# Altium schematic sheet Sheet_Connect[1].SchDoc
size A1
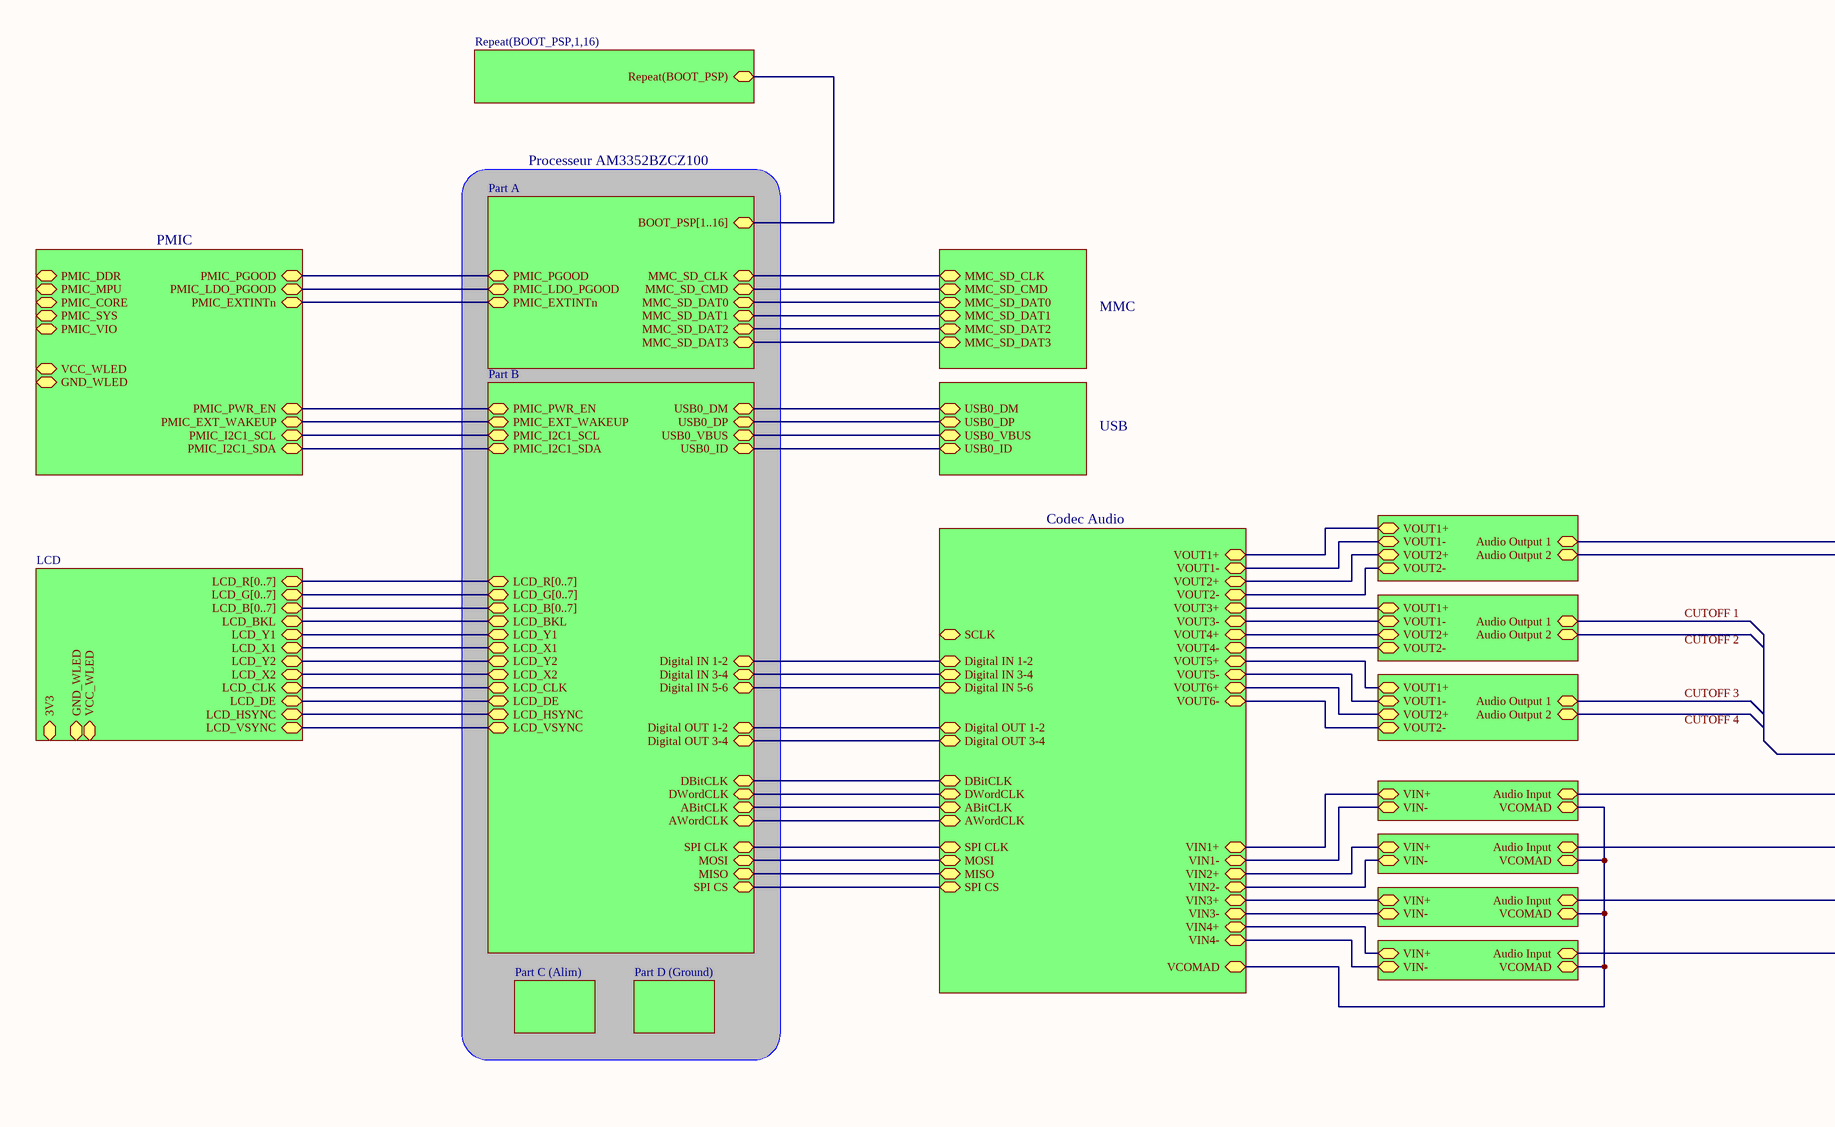
[diagram p0: Sheet_Connect[1].SchDoc, top left]
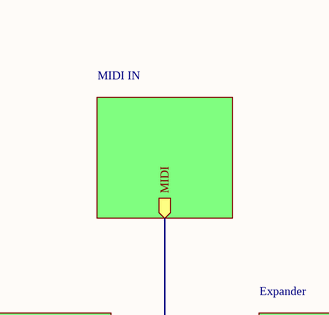
[diagram p1: Sheet_Connect[1].SchDoc, top right]
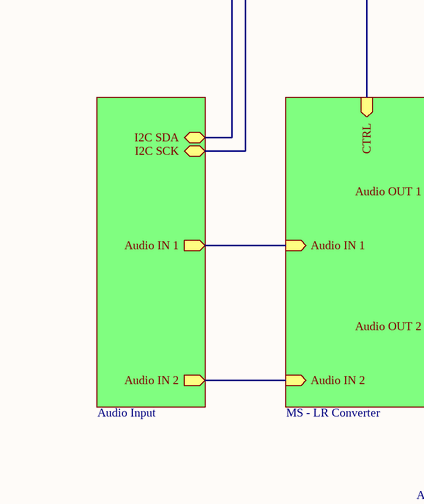
[diagram p2: Sheet_Connect[1].SchDoc, bottom left]
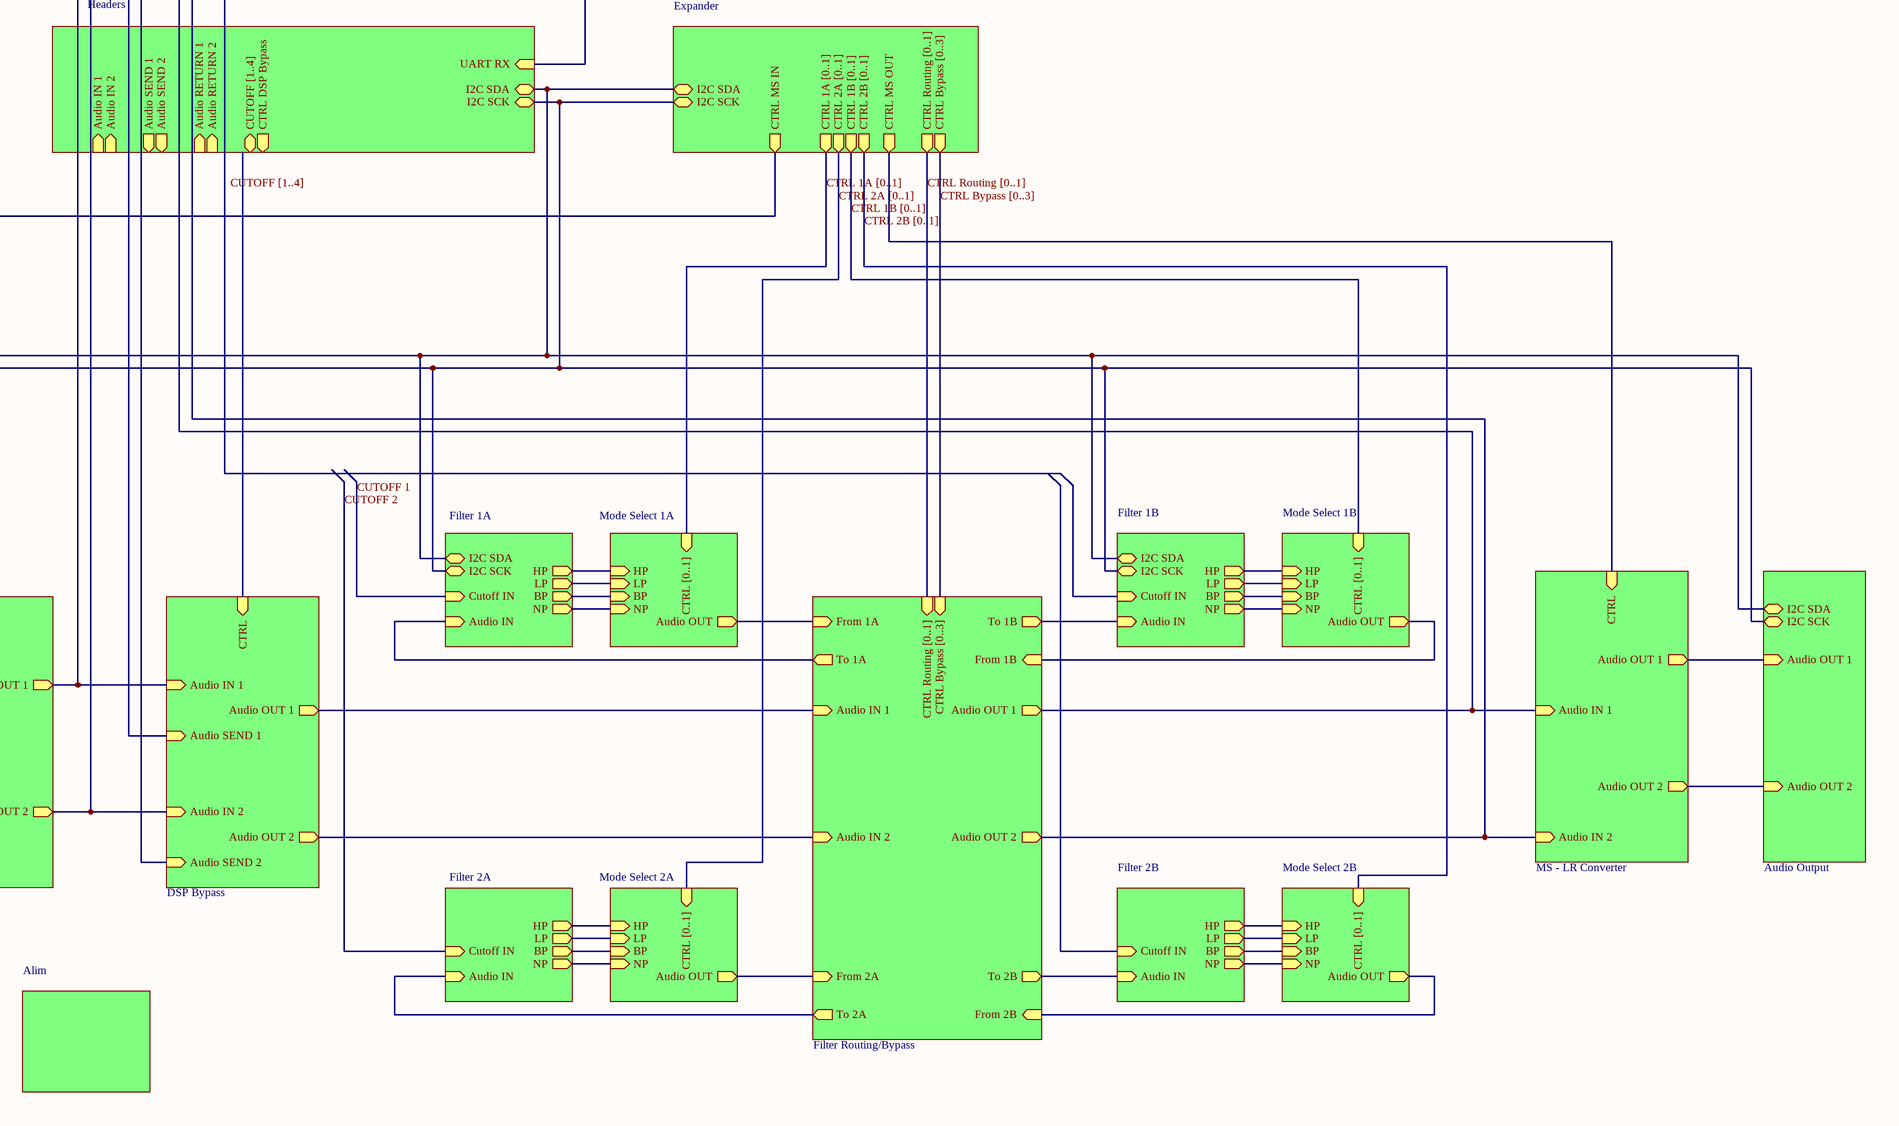
[diagram p3: Sheet_Connect[1].SchDoc, bottom right]

## Sub-sheets
Alim = P1_Alim.SchDoc: no entries
Audio Input = P2_AudioInput.SchDoc: Audio IN 1 (out), I2C SCK, I2C SDA, Audio IN 2 (out)
Audio Input L = Sh_Input.SchDoc: VIN+, VIN-, VCOMAD, Audio Input
Audio Input R = Sh_Input.SchDoc: VIN+, VIN-, VCOMAD, Audio Input
Audio Output = Sh_Output.SchDoc: VOUT1+, VOUT1-, VOUT2+, VOUT2-, Audio Output 1, Audio Output 2
Audio Output = Sh_Output.SchDoc: VOUT1+, VOUT1-, VOUT2+, VOUT2-, Audio Output 1, Audio Output 2
Audio Output = Sh_Output.SchDoc: VOUT1+, VOUT1-, VOUT2+, VOUT2-, Audio Output 1, Audio Output 2
Audio Output = P8_AudioOutput.SchDoc: Audio OUT 1 (in), I2C SCK, I2C SDA, Audio OUT 2 (in)
Audio Repeat L = Sh_Input.SchDoc: VIN+, VIN-, VCOMAD, Audio Input
Audio Repeat R = Sh_Input.SchDoc: VIN+, VIN-, VCOMAD, Audio Input
Codec Audio = Sh_ADC-DAC_Main.SchDoc: VOUT1+, VOUT1-, VOUT2+, VOUT2-, VOUT3+, VOUT3-, VOUT4+, VOUT4-, VOUT5+, VOUT5-, VOUT6+, VOUT6-, VIN1+, VIN1-, VIN2+, VIN2-, VIN3+, VIN3-, VIN4+, VIN4-, VCOMAD, SCLK, Digital IN 1-2, Digital IN 3-4, Digital IN 5-6, Digital OUT 1-2, Digital OUT 3-4, DBitCLK, DWordCLK, ABitCLK, AWordCLK, SPI CLK, MOSI, MISO, SPI CS
DSP Bypass = P4_DSPBypass.SchDoc: Audio SEND 1 (in), Audio SEND 2 (in), Audio IN 1 (in), Audio IN 2 (in), Audio OUT 1 (out), Audio OUT 2 (out), CTRL (in)
Expander = P10_Expander.SchDoc: I2C SCK, I2C SDA, CTRL MS IN (out), CTRL 1A [0..1] (out), CTRL 2A [0..1] (out), CTRL 1B [0..1] (out), CTRL 2B [0..1] (out), CTRL MS OUT (out), CTRL Routing [0..1] (out), CTRL Bypass [0..3] (out)
Filter 1A = P5a_Filter1A.SchDoc: HP (out), LP (out), BP (out), NP (out), Audio IN (in), I2C SCK, I2C SDA, Cutoff IN (in)
Filter 1B = P5c_Filter1B.SchDoc: HP (out), LP (out), BP (out), NP (out), Audio IN (in), I2C SCK, I2C SDA, Cutoff IN (in)
Filter 2A = P5b_Filter2A.SchDoc: HP (out), LP (out), BP (out), NP (out), Audio IN (in), Cutoff IN (in)
Filter 2B = P5d_Filter2B.SchDoc: HP (out), LP (out), BP (out), NP (out), Audio IN (in), Cutoff IN (in)
Filter Routing/Bypass = P7_FilterRoutingBypass.SchDoc: From 1A (in), From 2A (in), To 2A (out), To 1A (out), Audio IN 1 (in), Audio IN 2 (in), Audio OUT 1 (out), Audio OUT 2 (out), To 1B (out), From 1B (in), To 2B (out), From 2B (in), CTRL Routing [0..1] (in), CTRL Bypass [0..3] (in)
Headers = PX_Header.SchDoc: I2C SCK, I2C SDA, UART RX (in), Audio IN 1 (in), Audio IN 2 (in), Audio SEND 1 (out), Audio SEND 2 (out), Audio RETURN 1 (in), Audio RETURN 2 (in), CUTOFF [1..4], CTRL DSP Bypass (out)
LCD = LCD.SchDoc: 3V3, LCD_R[0..7], LCD_G[0..7], LCD_B[0..7], LCD_BKL, LCD_Y1, LCD_X1, LCD_Y2, LCD_X2, LCD_CLK, LCD_DE, GND_WLED, VCC_WLED, LCD_HSYNC, LCD_VSYNC
MIDI IN = P9_MIDI.SchDoc: MIDI (out)
MMC = MMC.SchDoc: MMC_SD_CMD, MMC_SD_DAT0, MMC_SD_DAT1, MMC_SD_DAT2, MMC_SD_DAT3, MMC_SD_CLK
Mode Select 1A = P6_FilterMode.SchDoc: HP (in), LP (in), BP (in), NP (in), Audio OUT (out), CTRL [0..1] (in)
Mode Select 1B = P6_FilterMode.SchDoc: HP (in), LP (in), BP (in), NP (in), Audio OUT (out), CTRL [0..1] (in)
Mode Select 2A = P6_FilterMode.SchDoc: HP (in), LP (in), BP (in), NP (in), Audio OUT (out), CTRL [0..1] (in)
Mode Select 2B = P6_FilterMode.SchDoc: HP (in), LP (in), BP (in), NP (in), Audio OUT (out), CTRL [0..1] (in)
MS - LR Converter = P3_MS.SchDoc: Audio IN 1 (in), Audio IN 2 (in), Audio OUT 1 (out), Audio OUT 2 (out), CTRL (in)
MS - LR Converter = P3_MS.SchDoc: Audio IN 1 (in), Audio IN 2 (in), Audio OUT 1 (out), Audio OUT 2 (out), CTRL (in)
Part A = PROC_partA_(SRAM,NAND,LCD).SchDoc: PMIC_PGOOD, PMIC_LDO_PGOOD, PMIC_EXTINTn, MMC_SD_CLK, MMC_SD_CMD, MMC_SD_DAT0, MMC_SD_DAT1, MMC_SD_DAT2, MMC_SD_DAT3, BOOT_PSP[1..16]
Part B = PROC_partB_(LCD).SchDoc: PMIC_EXT_WAKEUP, PMIC_PWR_EN, PMIC_I2C1_SCL, PMIC_I2C1_SDA, USB0_DM, USB0_DP, USB0_VBUS, USB0_ID, LCD_R[0..7], LCD_G[0..7], LCD_B[0..7], LCD_BKL, LCD_Y1, LCD_X1, LCD_Y2, LCD_X2, LCD_CLK, LCD_DE, LCD_HSYNC, LCD_VSYNC, Digital IN 1-2, Digital IN 3-4, Digital IN 5-6, Digital OUT 1-2, Digital OUT 3-4, DBitCLK, DWordCLK, ABitCLK, AWordCLK, SPI CLK, MOSI, MISO, SPI CS
Part C (Alim) = PROC_partC_(VDD).SchDoc: no entries
Part D (Ground) = PROC_partD_(VSS).SchDoc: no entries
PMIC = PMIC.SchDoc: PMIC_DDR, PMIC_MPU, PMIC_CORE, PMIC_SYS, PMIC_VIO, PMIC_PGOOD, PMIC_LDO_PGOOD, PMIC_EXTINTn, PMIC_EXT_WAKEUP, PMIC_PWR_EN, PMIC_I2C1_SCL, PMIC_I2C1_SDA, VCC_WLED, GND_WLED
Repeat(BOOT_PSP,1,16) = BOOT.SchDoc: Repeat(BOOT_PSP)
USB = Sh_USB.SchDoc: USB0_DM, USB0_DP, USB0_VBUS, USB0_ID

## Nets
CUTOFF 1: sheet Audio Output/Audio Output 1, sheet Filter 1A/Cutoff IN
CUTOFF 2: sheet Filter 2A/Cutoff IN
CUTOFF 3: sheet Audio Output/Audio Output 1
(unnamed): sheet Part A/PMIC_PGOOD, sheet PMIC/PMIC_PGOOD
(unnamed): sheet Part A/PMIC_LDO_PGOOD, sheet PMIC/PMIC_LDO_PGOOD
(unnamed): sheet Part A/PMIC_EXTINTn, sheet PMIC/PMIC_EXTINTn
(unnamed): sheet Part A/MMC_SD_CLK, sheet MMC/MMC_SD_CLK
(unnamed): sheet Part A/MMC_SD_CMD, sheet MMC/MMC_SD_CMD
(unnamed): sheet Part A/MMC_SD_DAT0, sheet MMC/MMC_SD_DAT0
(unnamed): sheet Part A/MMC_SD_DAT1, sheet MMC/MMC_SD_DAT1
(unnamed): sheet Part A/MMC_SD_DAT2, sheet MMC/MMC_SD_DAT2
(unnamed): sheet Part A/MMC_SD_DAT3, sheet MMC/MMC_SD_DAT3
(unnamed): sheet Part A/BOOT_PSP[1..16], sheet Repeat(BOOT_PSP,1,16)/Repeat(BOOT_PSP)
(unnamed): sheet Part B/PMIC_EXT_WAKEUP, sheet PMIC/PMIC_EXT_WAKEUP
(unnamed): sheet Part B/PMIC_PWR_EN, sheet PMIC/PMIC_PWR_EN
(unnamed): sheet Part B/PMIC_I2C1_SCL, sheet PMIC/PMIC_I2C1_SCL
(unnamed): sheet Part B/PMIC_I2C1_SDA, sheet PMIC/PMIC_I2C1_SDA
(unnamed): sheet Part B/USB0_DM, sheet USB/USB0_DM
(unnamed): sheet Part B/USB0_DP, sheet USB/USB0_DP
(unnamed): sheet Part B/USB0_VBUS, sheet USB/USB0_VBUS
(unnamed): sheet Part B/USB0_ID, sheet USB/USB0_ID
(unnamed): sheet Part B/LCD_BKL, sheet LCD/LCD_BKL
(unnamed): sheet Part B/LCD_Y1, sheet LCD/LCD_Y1
(unnamed): sheet Part B/LCD_X1, sheet LCD/LCD_X1
(unnamed): sheet Part B/LCD_Y2, sheet LCD/LCD_Y2
(unnamed): sheet Part B/LCD_X2, sheet LCD/LCD_X2
(unnamed): sheet Part B/LCD_CLK, sheet LCD/LCD_CLK
(unnamed): sheet Part B/LCD_DE, sheet LCD/LCD_DE
(unnamed): sheet Part B/LCD_HSYNC, sheet LCD/LCD_HSYNC
(unnamed): sheet Part B/LCD_VSYNC, sheet LCD/LCD_VSYNC
(unnamed): sheet Part B/Digital IN 1-2, sheet Codec Audio/Digital IN 1-2
(unnamed): sheet Part B/Digital IN 3-4, sheet Codec Audio/Digital IN 3-4
(unnamed): sheet Part B/Digital IN 5-6, sheet Codec Audio/Digital IN 5-6
(unnamed): sheet Part B/Digital OUT 1-2, sheet Codec Audio/Digital OUT 1-2
(unnamed): sheet Part B/Digital OUT 3-4, sheet Codec Audio/Digital OUT 3-4
(unnamed): sheet Part B/DBitCLK, sheet Codec Audio/DBitCLK
(unnamed): sheet Part B/DWordCLK, sheet Codec Audio/DWordCLK
(unnamed): sheet Part B/ABitCLK, sheet Codec Audio/ABitCLK
(unnamed): sheet Part B/AWordCLK, sheet Codec Audio/AWordCLK
(unnamed): sheet Part B/SPI CLK, sheet Codec Audio/SPI CLK
(unnamed): sheet Part B/MOSI, sheet Codec Audio/MOSI
(unnamed): sheet Part B/MISO, sheet Codec Audio/MISO
(unnamed): sheet Part B/SPI CS, sheet Codec Audio/SPI CS
(unnamed): sheet Codec Audio/VOUT1+, sheet Audio Output/VOUT1+
(unnamed): sheet Codec Audio/VOUT1-, sheet Audio Output/VOUT1-
(unnamed): sheet Codec Audio/VOUT2+, sheet Audio Output/VOUT2+
(unnamed): sheet Codec Audio/VOUT2-, sheet Audio Output/VOUT2-
(unnamed): sheet Codec Audio/VOUT3+, sheet Audio Output/VOUT1+
(unnamed): sheet Codec Audio/VOUT3-, sheet Audio Output/VOUT1-
(unnamed): sheet Codec Audio/VOUT4+, sheet Audio Output/VOUT2+
(unnamed): sheet Codec Audio/VOUT4-, sheet Audio Output/VOUT2-
(unnamed): sheet Codec Audio/VOUT5+, sheet Audio Output/VOUT1+
(unnamed): sheet Codec Audio/VOUT5-, sheet Audio Output/VOUT1-
(unnamed): sheet Codec Audio/VOUT6+, sheet Audio Output/VOUT2+
(unnamed): sheet Codec Audio/VOUT6-, sheet Audio Output/VOUT2-
(unnamed): sheet Codec Audio/VIN1+, sheet Audio Input L/VIN+
(unnamed): sheet Codec Audio/VIN1-, sheet Audio Input L/VIN-
(unnamed): sheet Codec Audio/VIN2+, sheet Audio Input R/VIN+
(unnamed): sheet Codec Audio/VIN2-, sheet Audio Input R/VIN-
(unnamed): sheet Codec Audio/VIN3+, sheet Audio Repeat L/VIN+
(unnamed): sheet Codec Audio/VIN3-, sheet Audio Repeat L/VIN-
(unnamed): sheet Codec Audio/VIN4+, sheet Audio Repeat R/VIN+
(unnamed): sheet Codec Audio/VIN4-, sheet Audio Repeat R/VIN-
(unnamed): sheet Codec Audio/VCOMAD, sheet Audio Input L/VCOMAD, sheet Audio Input R/VCOMAD, sheet Audio Repeat L/VCOMAD, sheet Audio Repeat R/VCOMAD
(unnamed): sheet Audio Output/Audio Output 1, sheet DSP Bypass/Audio SEND 2
(unnamed): sheet Audio Output/Audio Output 2, sheet DSP Bypass/Audio SEND 1
(unnamed): sheet Audio Input L/Audio Input, sheet DSP Bypass/Audio IN 2, sheet MS - LR Converter/Audio OUT 2
(unnamed): sheet Audio Input R/Audio Input, sheet DSP Bypass/Audio IN 1, sheet MS - LR Converter/Audio OUT 1
(unnamed): sheet Audio Repeat L/Audio Input, sheet Filter Routing/Bypass/Audio OUT 2, sheet MS - LR Converter/Audio IN 2
(unnamed): sheet Audio Repeat R/Audio Input, sheet Filter Routing/Bypass/Audio OUT 1, sheet MS - LR Converter/Audio IN 1
(unnamed): sheet Audio Input/Audio IN 1, sheet MS - LR Converter/Audio IN 1
(unnamed): sheet Audio Input/I2C SCK, sheet Headers/I2C SCK, sheet Filter 1A/I2C SCK, sheet Filter 1B/I2C SCK, sheet Audio Output/I2C SCK, sheet Expander/I2C SCK
(unnamed): sheet Audio Input/I2C SDA, sheet Headers/I2C SDA, sheet Filter 1A/I2C SDA, sheet Filter 1B/I2C SDA, sheet Audio Output/I2C SDA, sheet Expander/I2C SDA
(unnamed): sheet Audio Input/Audio IN 2, sheet MS - LR Converter/Audio IN 2
(unnamed): sheet Headers/UART RX, sheet MIDI IN/MIDI
(unnamed): sheet DSP Bypass/Audio OUT 1, sheet Filter Routing/Bypass/Audio IN 1
(unnamed): sheet DSP Bypass/Audio OUT 2, sheet Filter Routing/Bypass/Audio IN 2
(unnamed): sheet MS - LR Converter/CTRL, sheet Expander/CTRL MS IN
(unnamed): sheet Filter 1A/HP, sheet Mode Select 1A/HP
(unnamed): sheet Filter 1A/LP, sheet Mode Select 1A/LP
(unnamed): sheet Filter 1A/BP, sheet Mode Select 1A/BP
(unnamed): sheet Filter 1A/NP, sheet Mode Select 1A/NP
(unnamed): sheet Filter 1A/Audio IN, sheet Filter Routing/Bypass/To 1A
(unnamed): sheet Mode Select 1A/Audio OUT, sheet Filter Routing/Bypass/From 1A
(unnamed): sheet Filter 2A/HP, sheet Mode Select 2A/HP
(unnamed): sheet Filter 2A/LP, sheet Mode Select 2A/LP
(unnamed): sheet Filter 2A/BP, sheet Mode Select 2A/BP
(unnamed): sheet Filter 2A/NP, sheet Mode Select 2A/NP
(unnamed): sheet Filter 2A/Audio IN, sheet Filter Routing/Bypass/To 2A
(unnamed): sheet Mode Select 2A/Audio OUT, sheet Filter Routing/Bypass/From 2A
(unnamed): sheet Filter Routing/Bypass/To 1B, sheet Filter 1B/Audio IN
(unnamed): sheet Filter Routing/Bypass/From 1B, sheet Mode Select 1B/Audio OUT
(unnamed): sheet Filter Routing/Bypass/To 2B, sheet Filter 2B/Audio IN
(unnamed): sheet Filter Routing/Bypass/From 2B, sheet Mode Select 2B/Audio OUT
(unnamed): sheet Filter 1B/HP, sheet Mode Select 1B/HP
(unnamed): sheet Filter 1B/LP, sheet Mode Select 1B/LP
(unnamed): sheet Filter 1B/BP, sheet Mode Select 1B/BP
(unnamed): sheet Filter 1B/NP, sheet Mode Select 1B/NP
(unnamed): sheet Filter 2B/HP, sheet Mode Select 2B/HP
(unnamed): sheet Filter 2B/LP, sheet Mode Select 2B/LP
(unnamed): sheet Filter 2B/BP, sheet Mode Select 2B/BP
(unnamed): sheet Filter 2B/NP, sheet Mode Select 2B/NP
(unnamed): sheet MS - LR Converter/Audio OUT 1, sheet Audio Output/Audio OUT 1
(unnamed): sheet MS - LR Converter/Audio OUT 2, sheet Audio Output/Audio OUT 2
(unnamed): sheet MS - LR Converter/CTRL, sheet Expander/CTRL MS OUT

## Buses and harness runs
bus CTRL 1A [0..1] = sheet Expander/CTRL 1A [0..1] = sheet Mode Select 1A/CTRL [0..1]
bus CTRL 1B [0..1] = sheet Expander/CTRL 1B [0..1] = sheet Mode Select 1B/CTRL [0..1]
bus CTRL 2A [0..1] = sheet Expander/CTRL 2A [0..1] = sheet Mode Select 2A/CTRL [0..1]
bus CTRL 2B [0..1] = sheet Expander/CTRL 2B [0..1] = sheet Mode Select 2B/CTRL [0..1]
bus CTRL Bypass [0..3] = sheet Expander/CTRL Bypass [0..3] = sheet Filter Routing/Bypass/CTRL Bypass [0..3]
bus CTRL Routing [0..1] = sheet Expander/CTRL Routing [0..1] = sheet Filter Routing/Bypass/CTRL Routing [0..1]
bus CUTOFF [1..4]
bus sheet LCD/LCD_B[0..7] = sheet Part B/LCD_B[0..7]
bus sheet LCD/LCD_G[0..7] = sheet Part B/LCD_G[0..7]
bus sheet LCD/LCD_R[0..7] = sheet Part B/LCD_R[0..7]

## Notes on the sheet
- Processeur AM3352BZCZ100
- Labels drawn without touching a wire or pin: CUTOFF 2, CUTOFF 4, CUTOFF [1..4]